# Altium schematic sheet Sheet1.SchDoc
size A
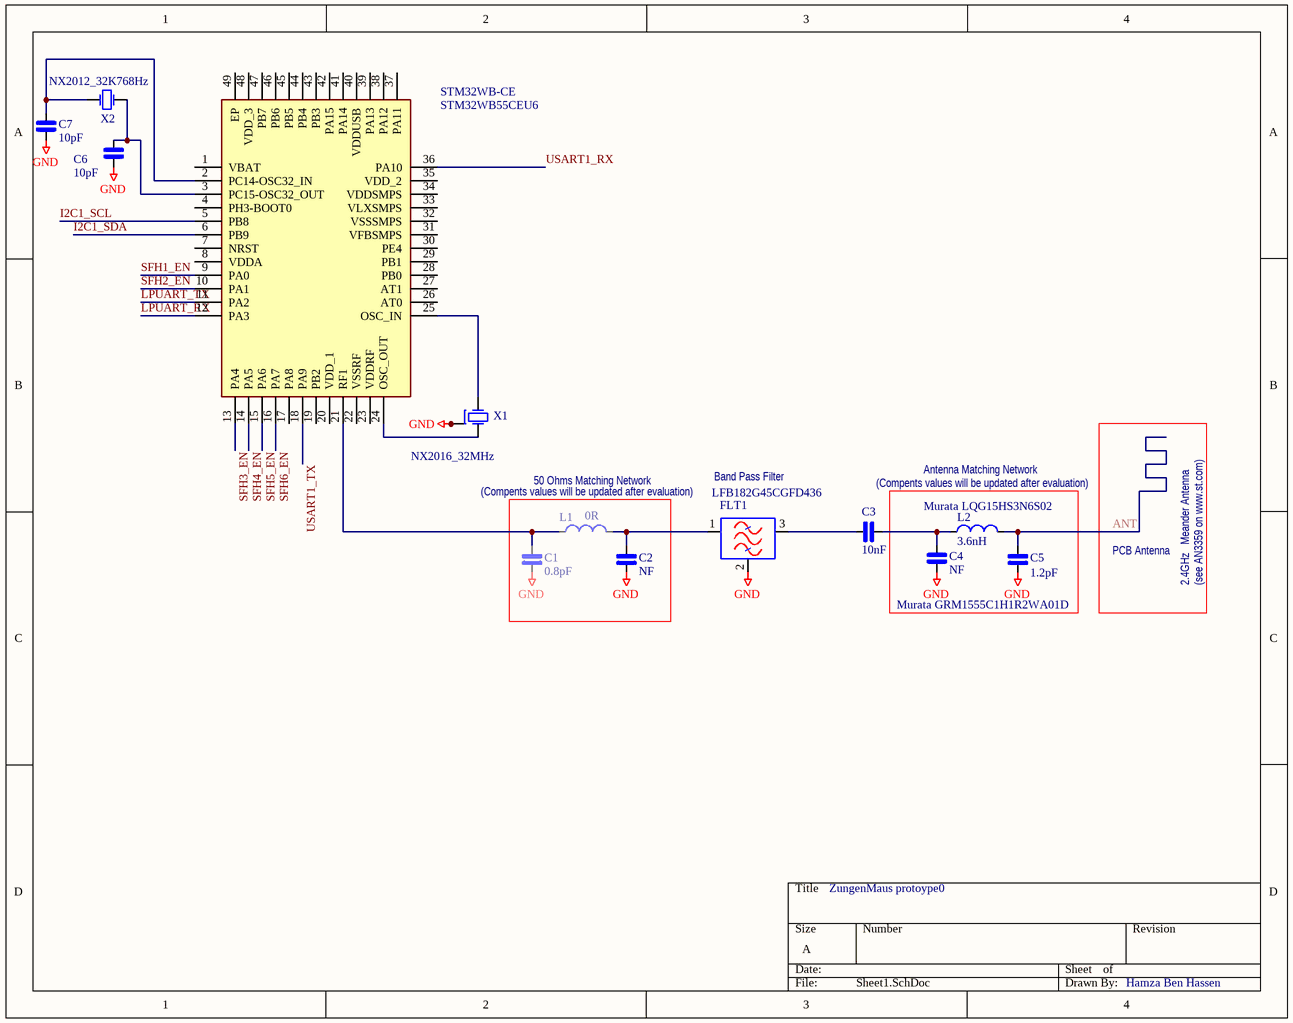
[diagram p0: Sheet1.SchDoc]

## Parts
C1  0.8pF  [0402_CAP_NPOL]
C2  NF  [0402_CAP_NPOL]
C3  10nF  [0402_CAP_NPOL]
C4  NF  [0402_CAP_NPOL]
C5  1.2pF  Ref: Murata GRM1555C1H1R2WA01D  [0402_CAP_NPOL]
C6  10pF  [0402_CAP_NPOL]
C7  10pF  [0402_CAP_NPOL]
FLT1  LFB182G45CGFD436  [LFB182G45CGFD436]
L1  0R  [0402_COIL]
L2  3.6nH  Ref: Murata LQG15HS3N6S02  [0402_COIL]
STM32WB-CE  STM32WB55CEU6  [QFN50P700X700X65-49N-D]
X1  NX2016_32MHz  [NX2016_4P]
X2  NX2012_32K768Hz  [NX2012_2P]

## Blocks framed on the sheet
50 Ohms Matching Network: C1 C2 L1
Antenna Matching Network: C4 C5 L2

## Nets
GND: C1.1 C2.1 C4.2 C5.1 C6.2 C7.2 FLT1.2(GND) X1.2 X1.4
ANT: C5.2 L2.2
I2C1_SCL: STM32WB-CE.5(PB8)
I2C1_SDA: STM32WB-CE.6(PB9)
LPUART_RX: STM32WB-CE.12(PA3)
LPUART_TX: STM32WB-CE.11(PA2)
SFH1_EN: STM32WB-CE.9(PA0)
SFH2_EN: STM32WB-CE.10(PA1)
SFH3_EN: STM32WB-CE.13(PA4)
SFH4_EN: STM32WB-CE.14(PA5)
SFH5_EN: STM32WB-CE.15(PA6)
SFH6_EN: STM32WB-CE.16(PA7)
USART1_RX: STM32WB-CE.36(PA10)
USART1_TX: STM32WB-CE.18(PA9)
NetC1_2: C1.2 L1.1 STM32WB-CE.21(RF1)
NetC2_2: C2.2 FLT1.1(I/O) L1.2
NetC3_1: C3.1 FLT1.3(I/O)
NetC3_2: C3.2 C4.1 L2.1
NetC6_1: C6.1 STM32WB-CE.3(PC15-OSC32_OUT) X2.2(OSC2)
NetC7_1: C7.1 STM32WB-CE.2(PC14-OSC32_IN) X2.1(OSC1)
NetSTM32WB-CE_24: STM32WB-CE.24(OSC_OUT) X1.3(OSC2)
NetSTM32WB-CE_25: STM32WB-CE.25(OSC_IN) X1.1(OSC1)

Not connected (* = marked no-connect by the designer): STM32WB-CE 1(VBAT) 4(PH3-BOOT0) 7(NRST) 8(VDDA) 17(PA8) 19(PB2) 20(VDD_1) 22(VSSRF) 23(VDDRF) 26(AT0) 27(AT1) 28(PB0) 29(PB1) 30(PE4) 31(VFBSMPS) 32(VSSSMPS) 33(VLXSMPS) 34(VDDSMPS) 35(VDD_2) 37(PA11) 38(PA12) 39(PA13) 40(VDDUSB) 41(PA14) 42(PA15) 43(PB3) 44(PB4) 45(PB5) 46(PB6) 47(PB7) 48(VDD_3) 49(EP)

## Notes on the sheet
- (Compents values will be updated after evaluation)
- Band Pass Filter
- PCB Antenna
- Meander Antenna
- 2.4GHz
- (see AN3359 on www.st.com)
- ZungenMaus protoype0
- Hamza Ben Hassen

## Library data of the parts
C1-C7 = CAP_NPOL: Capacitor_not polarized
  C5: Fitted: Fitted
FLT1 = LFB182G45CGFD436: Band Pass Filter Murata LFB182G45CGFD436
L1 L2 = INDUCTOR_SMD_STDL
STM32WB-CE = STM32WB55CEU6: Integrated Circuit; Manufacturer_Name: STMicroelectronics; Datasheet Link: https://componentsearchengine.com/Datasheets/1/STM32WB55CEU6.pdf; Height: 0.65mm; Mouser Part Number: 511-STM32WB55CEU6; Mouser Price/Stock: https://www.mouser.com/Search/Refine.aspx?Keyword=511-STM32WB55CEU6; Manufacturer_Part_Number: STM32WB55CEU6
X1 = NX2016_32M: Crystal NDK 2.0x1.6mm  32 MHz; Manufacturer P/N: NX2016SA 32 MHz EXS00A-CS06654; Manufacturer: NDK
X2 = NX2012_32K768: Crystal NDK 2.0x1.2mm  32.768 KHz; Manufacturer P/N: NX2012SA 32.768KHz  EXS00A-MU00389; Manufacturer: NDK